# Altium schematic sheet TMS.SchDoc: TMS Circuit
size A4; Date: 11.05.2017; DrawnBy: Caner ALP; Organization: Eastern Mediterranean University; DocumentNumber: 1; SheetNumber: 1; SheetTotal: 4; DocumentName: TMS Circuit; ProjectName: Tubitak Electric Vehicle Motor Control Board
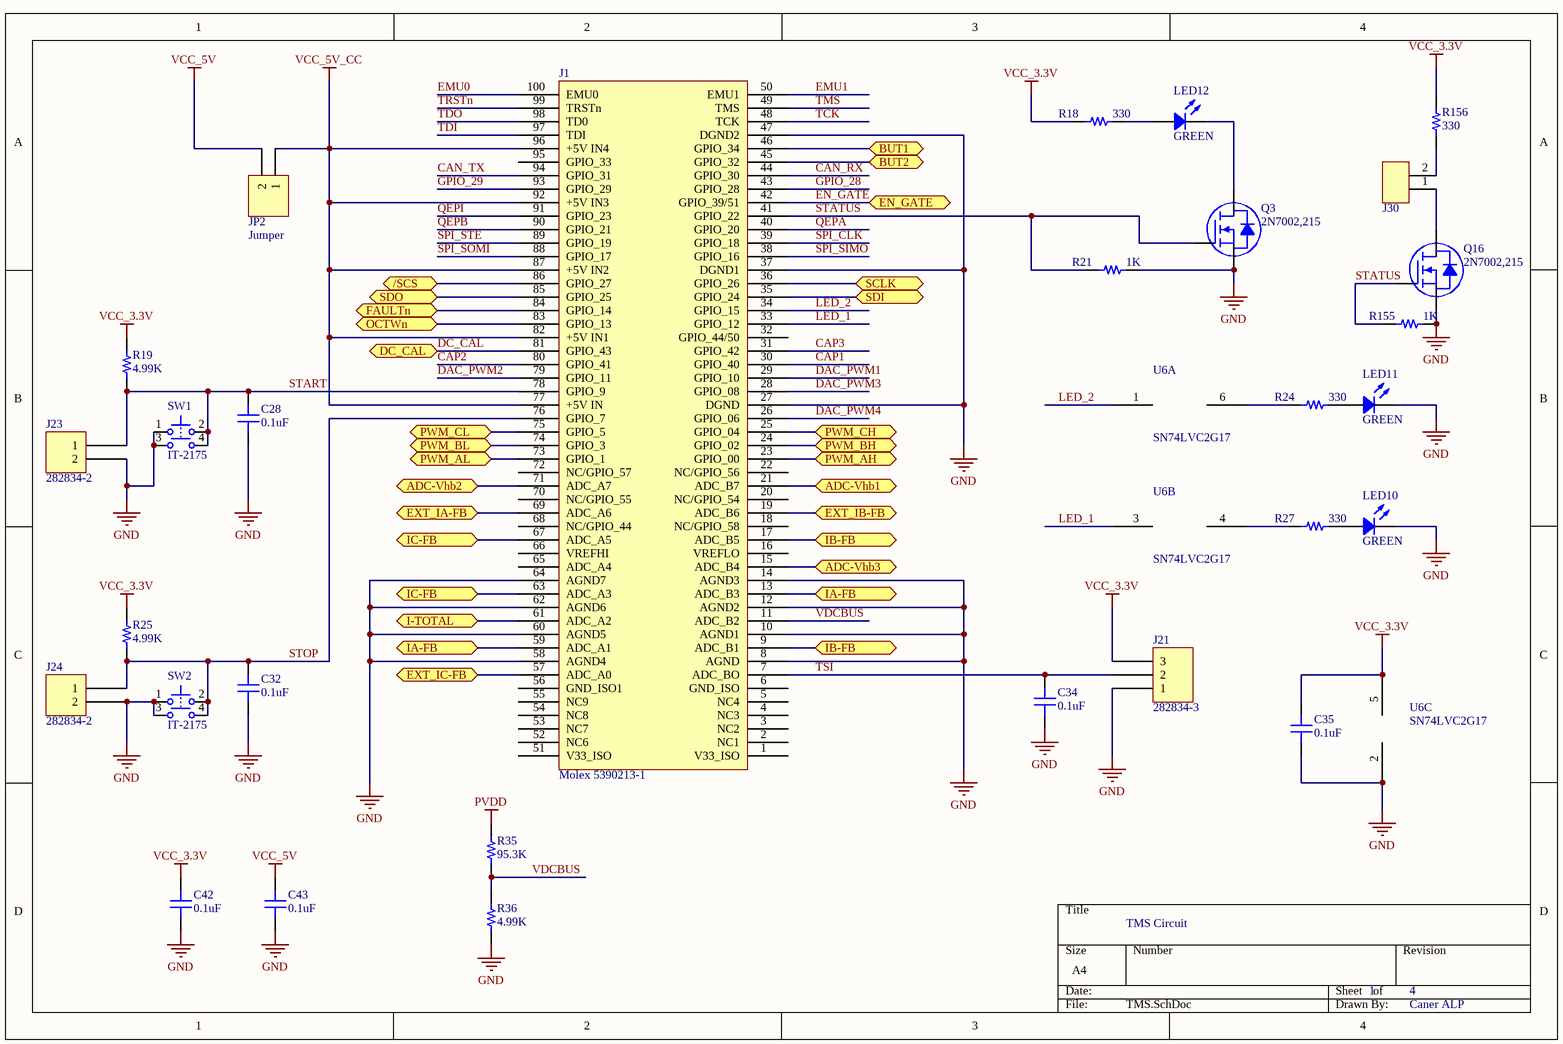
[diagram p0: TMS.SchDoc]

## Parts
C28  0.1uF  [CAP 0603/1608]
C32  0.1uF  [CAP 0603/1608]
C34  0.1uF  [CAP 0603/1608]
C35  0.1uF  [CAP 0603/1608]
C42  0.1uF  [CAP 0603/1608]
C43  0.1uF  [CAP 0603/1608]
J1  Molex 5390213-1  [DIMM100]
J21  282834-3  [TE 282834-3]
J23  282834-2  [TE 282834-2]
J24  282834-2  [TE 282834-2]
J30  HDR_1x2  [PINHEAD_2.54mm_1x2]  (value not drawn)
JP2  Jumper  [Header 2.54mm - duplicate]
LED10  GREEN  [LED 0805/2012 YELLOW]
LED11  GREEN  [LED 0805/2012 YELLOW]
LED12  GREEN  [LED 0805/2012 YELLOW]
Q3  2N7002,215  [NXP SOT-23-3 TO-236AB]
Q16  2N7002,215  [NXP SOT-23-3 TO-236AB]
R18  330  [RES 0603/1608]
R19  4.99K  [RES 0603/1608]
R21  1K  [RES 0603/1608]
R24  330  [RES 0603/1608]
R25  4.99K  [RES 0603/1608]
R27  330  [RES 0603/1608]
R35  95.3K  [RES 0603/1608]
R36  4.99K  [RES 0603/1608]
R155  1K  [RES 0603/1608]
R156  330  [RES 0603/1608]
SW1  IT-2175  [Tick Tole Switch]
SW2  IT-2175  [Tick Tole Switch]
U6  SN74LVC2G17  [DBV006]  (parts A,B,C of 3)

## Ports
/SCS, ADC-Vhb1, ADC-Vhb2, ADC-Vhb3, BUT1, BUT2, DC_CAL, EN_GATE, EXT_IA-FB, EXT_IB-FB, EXT_IC-FB, FAULTn, I-TOTAL, IA-FB, IB-FB, IC-FB, OCTWn, PWM_AH, PWM_AL, PWM_BH, PWM_BL, PWM_CH, PWM_CL, SCLK, SDI, SDO

## Nets
GND: C28.1 C32.1 C34.1 C35.1 C42.1 C43.1 J1.8(AGND) J1.10(AGND1) J1.12(AGND2) J1.14(AGND3) J1.27(DGND) J1.37(DGND1) J1.47(DGND2) J1.58(AGND4) J1.60(AGND5) J1.62(AGND6) J1.64(AGND7) J21.1 J23.2 J24.2 LED10.2 LED11.2 Q3.3(S) Q16.3(S) R21.2 R36.2 R155.2 SW1.1 SW1.3 SW2.1 SW2.3 U6.2(EMU2)
PVDD: R35.1
VCC_3.3V: C35.2 C42.2 J21.3 R18.1 R19.2 R25.2 R156.2 U6.5(EMU1)
VCC_5V: C43.2 JP2.2
VCC_5V_CC: J1.77(+5V_IN) J1.82(+5V_IN1) J1.87(+5V_IN2) J1.92(+5V_IN3) J1.96(+5V_IN4) JP2.1
/SCS: J1.86(GPIO_27) ; port /SCS
ADC-Vhb1: J1.21(ADC_B7) ; port ADC-Vhb1
ADC-Vhb2: J1.71(ADC_A7) ; port ADC-Vhb2
ADC-Vhb3: J1.15(ADC_B4) ; port ADC-Vhb3
BUT1: J1.46(GPIO_34) ; port BUT1
BUT2: J1.45(GPIO_32) ; port BUT2
CAN_RX: J1.44(GPIO_30)
CAN_TX: J1.94(GPIO_31)
CAP1: J1.30(GPIO_40)
CAP2: J1.80(GPIO_41)
CAP3: J1.31(GPIO_42)
DAC_PWM1: J1.29(GPIO_10)
DAC_PWM2: J1.79(GPIO_11)
DAC_PWM3: J1.28(GPIO_08)
DAC_PWM4: J1.26(GPIO_06)
DC_CAL: J1.81(GPIO_43) ; port DC_CAL
EMU0: J1.100(EMU0)
EMU1: J1.50(EMU1)
EN_GATE: J1.42(GPIO_39/51) ; port EN_GATE
EXT_IA-FB: J1.69(ADC_A6) ; port EXT_IA-FB
EXT_IB-FB: J1.19(ADC_B6) ; port EXT_IB-FB
EXT_IC-FB: J1.57(ADC_A0) ; port EXT_IC-FB
FAULTn: J1.84(GPIO_14) ; port FAULTn
GPIO_28: J1.43(GPIO_28)
GPIO_29: J1.93(GPIO_29)
I-TOTAL: J1.61(ADC_A2) ; port I-TOTAL
IA-FB: J1.13(ADC_B3) J1.59(ADC_A1) ; port IA-FB
IB-FB: J1.9(ADC_B1) J1.17(ADC_B5) ; port IB-FB
IC-FB: J1.63(ADC_A3) J1.67(ADC_A5) ; port IC-FB
LED_1: J1.33(GPIO_12) U6.3(EMU1)
LED_2: J1.34(GPIO_15) U6.1(EMU1)
OCTWn: J1.83(GPIO_13) ; port OCTWn
PWM_AH: J1.23(GPIO_00) ; port PWM_AH
PWM_AL: J1.73(GPIO_1) ; port PWM_AL
PWM_BH: J1.24(GPIO_02) ; port PWM_BH
PWM_BL: J1.74(GPIO_3) ; port PWM_BL
PWM_CH: J1.25(GPIO_04) ; port PWM_CH
PWM_CL: J1.75(GPIO_5) ; port PWM_CL
QEPA: J1.40(GPIO_20)
QEPB: J1.90(GPIO_21)
QEPI: J1.91(GPIO_23)
SCLK: J1.36(GPIO_26) ; port SCLK
SDI: J1.35(GPIO_24) ; port SDI
SDO: J1.85(GPIO_25) ; port SDO
SPI_CLK: J1.39(GPIO_18)
SPI_SIMO: J1.38(GPIO_16)
SPI_SOMI: J1.88(GPIO_17)
SPI_STE: J1.89(GPIO_19)
START: C28.2 J1.78(GPIO_9) J23.1 R19.1 SW1.2 SW1.4
STATUS: J1.41(GPIO_22) Q3.1(G) Q16.1(G) R21.1 R155.1
STOP: C32.2 J1.76(GPIO_7) J24.1 R25.1 SW2.2 SW2.4
TCK: J1.48(TCK)
TDI: J1.97(TDI)
TDO: J1.98(TD0)
TMS: J1.49(TMS)
TRSTn: J1.99(TRSTn)
TSI: C34.2 J1.7(ADC_BO) J21.2
VDCBUS: J1.11(ADC_B2) R35.2 R36.1
NetJ30_1: J30.1 Q16.2(D)
NetJ30_2: J30.2 R156.1
NetLED10_1: LED10.1 R27.2
NetLED11_1: LED11.1 R24.2
NetLED12_1: LED12.1 R18.2
NetLED12_2: LED12.2 Q3.2(D)
NetR24_1: R24.1 U6.6(EMU2)
NetR27_1: R27.1 U6.4(EMU2)

Not connected (* = marked no-connect by the designer): J1 1(V33_ISO) 2(NC1) 3(NC2) 4(NC3) 5(NC4) 6(GND_ISO) 16(VREFLO) 18(NC/GPIO_58) 20(NC/GPIO_54) 22(NC/GPIO_56) 32(GPIO_44/50) 51(V33_ISO) 52(NC6) 53(NC7) 54(NC8) 55(NC9) 56(GND_ISO1) 65(ADC_A4) 66(VREFHI) 68(NC/GPIO_44) 70(NC/GPIO_55) 72(NC/GPIO_57) 95(GPIO_33)

## Library data of the parts
C28 C32 C34 C35 C42 C43 = CC0603KPX7R7BB104: CAP CER 0.1UF 16V X7R 0603; Manufacturer: Yageo; TemperatureRange: -55C ~ 125C; Tolerance: 10%; Value: 0.1uF; Part Number: CC0603KPX7R7BB104; PartId: 5262; Supplier 1: Digi-Key; Supplier Part Number 1: 311-1335-2-ND; ComponentLink1Description: Datasheet; ComponentLink1URL: http://www.yageo.com/documents/recent/UPY-GPHC_X7R_6.3V-to-50V-v12.pdf; ComponentLink2Description: Digi-Key listing; ComponentLink2URL: http://digikey.com/product-detail/en/CC0603KPX7R7BB104/311-1335-2-ND/2103073; TemperatureCoefficient: X7R; Voltage: 16V; Price: 0,0043; Type: -; Device Package: 0603 (1608 Metric)
J1 = DIMM100 DRAM: DIMM Connectors DIMM SKT 100P 2.54mm
J21 = 282834-3: TERM BLOCK 3POS SIDE ENT 2.54MM; Manufacturer: TE Connectivity AMP Connectors; TemperatureRange: -40C ~ 105C; Voltage: 150V; Pitch: 0.100" (2.54mm); Number Of Levels: 1; Positions Per Level: 3; Part Number: 282834-3; PartId: 9290; Supplier 1: Digi-Key; Supplier Part Number 1: A98334-ND; ComponentLink1Description: Datasheet; ComponentLink1URL: http://www.te.com/commerce/DocumentDelivery/DDEController?Action=srchrtrv&DocNm=282834&DocType=Customer+Drawing&DocLang=English; ComponentLink2Description: Digi-Key Listing; ComponentLink2URL: http://www.digikey.ca/product-detail/en/282834-3/A98334-ND/1153264; Price: 2,25; Colour: Green; Orientation: Horizontal with Board
J23 J24 = 282834-2: TERM BLOCK 2POS SIDE ENT 2.54MM; Manufacturer: TE Connectivity AMP Connectors; TemperatureRange: -40C ~ 105C; Voltage: 150V; Pitch: 0.100" (2.54mm); Number Of Levels: 1; Positions Per Level: 2; Part Number: 282834-2; PartId: 9289; Supplier 1: Digi-Key; Supplier Part Number 1: A98333-ND; ComponentLink1Description: Datasheet; ComponentLink1URL: http://www.te.com/commerce/DocumentDelivery/DDEController?Action=srchrtrv&DocNm=282834&DocType=Customer+Drawing&DocLang=English; ComponentLink2Description: Digi-Key Listing; ComponentLink2URL: http://www.digikey.ca/product-detail/en/282834-2/A98333-ND/1150135; Price: 1,3; Colour: Green; Orientation: Horizontal with Board
J30 = J00093: CONN HEADER 2POS .100 VERT TIN; Part Number: J00093; Manufacturer: Molex, LLC; Manufacturer Part Number: 22284020; Connector Type: Header, Unshrouded, Breakaway; Pitch: 2.54mm; Number of Positions: 2; Current Rating: 4A; Voltage - Rated: 250V; Series: KK® 42375; Supplier 1: Digi-Key; Contact Type: Male Pin; Mounting Type: Through Hole; Supplier Part Number 1: WM50014-02-ND; HelpURL: http://www.molex.com/pdm_docs/sd/022284020_sd.pdf; Operating Temperature: -40°C ~ 105°C; Contact Finish: Tin; Housing Color: Black; Number of Rows: 1
JP2 = Header 2: Header, 2-Pin; LatestRevisionDate: 17-Jul-2002; LatestRevisionNote: Re-released for DXP Platform.; Publisher: Altium Limited
LED10-LED12 = LTST-C170KFKT: LED ORANGE CLEAR 0805 SMD; Manufacturer: Lite-On Inc.; Type: Surface Mount; Millicandela: 90mcd; Voltage Forward: 2V; Current (Test): 20mA; Viewing Angle: 130; Value: Green; Part Number: LTST-C170KFKT; PartId: 7079; Supplier 1: Digi-Key; Supplier Part Number 1: 160-1413-2-ND; ComponentLink1Description: Datasheet; ComponentLink1URL: http://optoelectronics.liteon.com/upload/download/DS-22-99-0185/S_110_LTST-C170KFKT.pdf; ComponentLink2Description: Digi-Key Listing; ComponentLink2URL: http://www.digikey.ca/product-detail/en/LTST-C170KFKT/160-1413-2-ND/386775; Price: 0,0638; Device Package: 0805 (2012 Metric); Colour: Orange; Lens Transparency: Clear
Q3 Q16 = 2N7002,215: MOSFET N-CH 60V 300MA SOT-23; Manufacturer: NXP Semiconductors; Type: MOSFET N-Channel, Metal Oxide; Rds On (Max) at Id, Vgs: 5 Ohm @ 500mA, 10V; Vgs(th) (Max) at Id: 2.5V @ 250uA; Input Capacitance (Ciss) at Vds: 50pF @ 10V; Power - Max: 830mW; Current Continuous Drain: 300mA (Ta); Part Number: 2N7002,215; PartId: 7965; Supplier 1: Digi-Key; Supplier Part Number 1: 568-1369-2-ND; ComponentLink1Description: Datasheet; ComponentLink1URL: http://www.nxp.com/documents/data_sheet/2N7002.pdf; ComponentLink2Description: Digi-Key Listing; ComponentLink2URL: http://www.digikey.com/product-detail/en/2N7002,215/568-1369-2-ND/762973; Price: 0,0368; Device Package: TO-236-3, SC-59, SOT-23-3; Gate Charge (Qg): -; Drain to Source Voltage (Vdss): 60V; Features: Logic Level Gate
R18 R24 R27 R156 = ERJ-3GEYJ331V: RES SMD 330 OHM 5% 1/10W 0603; Manufacturer: Panasonic Electronic Components; TemperatureRange: -55C ~ 155C; TemperatureCoefficient: 200ppm/C; PowerRating: 0.1W, 1/10W; Value: 330; Part Number: ERJ-3GEYJ331V; PartId: 11189; Supplier 1: Digi-Key; Supplier Part Number 1: P330GTR-ND; ComponentLink1Description: Datasheet; ComponentLink1URL: http://industrial.panasonic.com/www-cgi/jvcr13pz.cgi?E+PZ+3+AOA0001+ERJ3GEYJ331V+7+WW; ComponentLink2Description: Digi-Key Listing; ComponentLink2URL: https://www.digikey.com/product-detail/en/panasonic-electronic-components/ERJ-3GEYJ331V/P330GTR-ND/135755; Tolerance: 5%; Price: 0,002; Device Package: 0603 (1608 Metric)
R19 R21 R25 R35 R36 R155 = ERJ-3GEYJ331V: RES SMD 330 OHM 5% 1/10W 0603; Manufacturer: Panasonic Electronic Components; Value: 330; TemperatureRange: -55C ~ 155C; TemperatureCoefficient: 200ppm/C; PowerRating: 0.1W, 1/10W; Part Number: ERJ-3GEYJ331V; PartId: 11189; Supplier 1: Digi-Key; Supplier Part Number 1: P330GTR-ND; ComponentLink1Description: Datasheet; ComponentLink1URL: http://industrial.panasonic.com/www-cgi/jvcr13pz.cgi?E+PZ+3+AOA0001+ERJ3GEYJ331V+7+WW; ComponentLink2Description: Digi-Key Listing; ComponentLink2URL: https://www.digikey.com/product-detail/en/panasonic-electronic-components/ERJ-3GEYJ331V/P330GTR-ND/135755; Tolerance: 5%; Price: 0,002; Device Package: 0603 (1608 Metric)
SW1 SW2 = IT-2175: Tactile Switch, DPST; Thru-Hole; Vertical; Rating DC 12V, 50mA (max); PackageDocument: Rev.0; Published: 6-Jun-2005; DatasheetDocument: Rev.0; PackageReference: IT-2175; Publisher: Altium Limited; ComponentLink1Description: Manufacturer Link; ComponentLink1URL: http://www.ilswitch.com/; ComponentLink2Description: Device Overview; ComponentLink2URL: http://www.ilswitch.com/list.php?ac_id=010112&ai_id=91